# EAGLE schematic OSSI-1 Beacon (EAGLE 6.5.0)

## Sheet 1 of 4
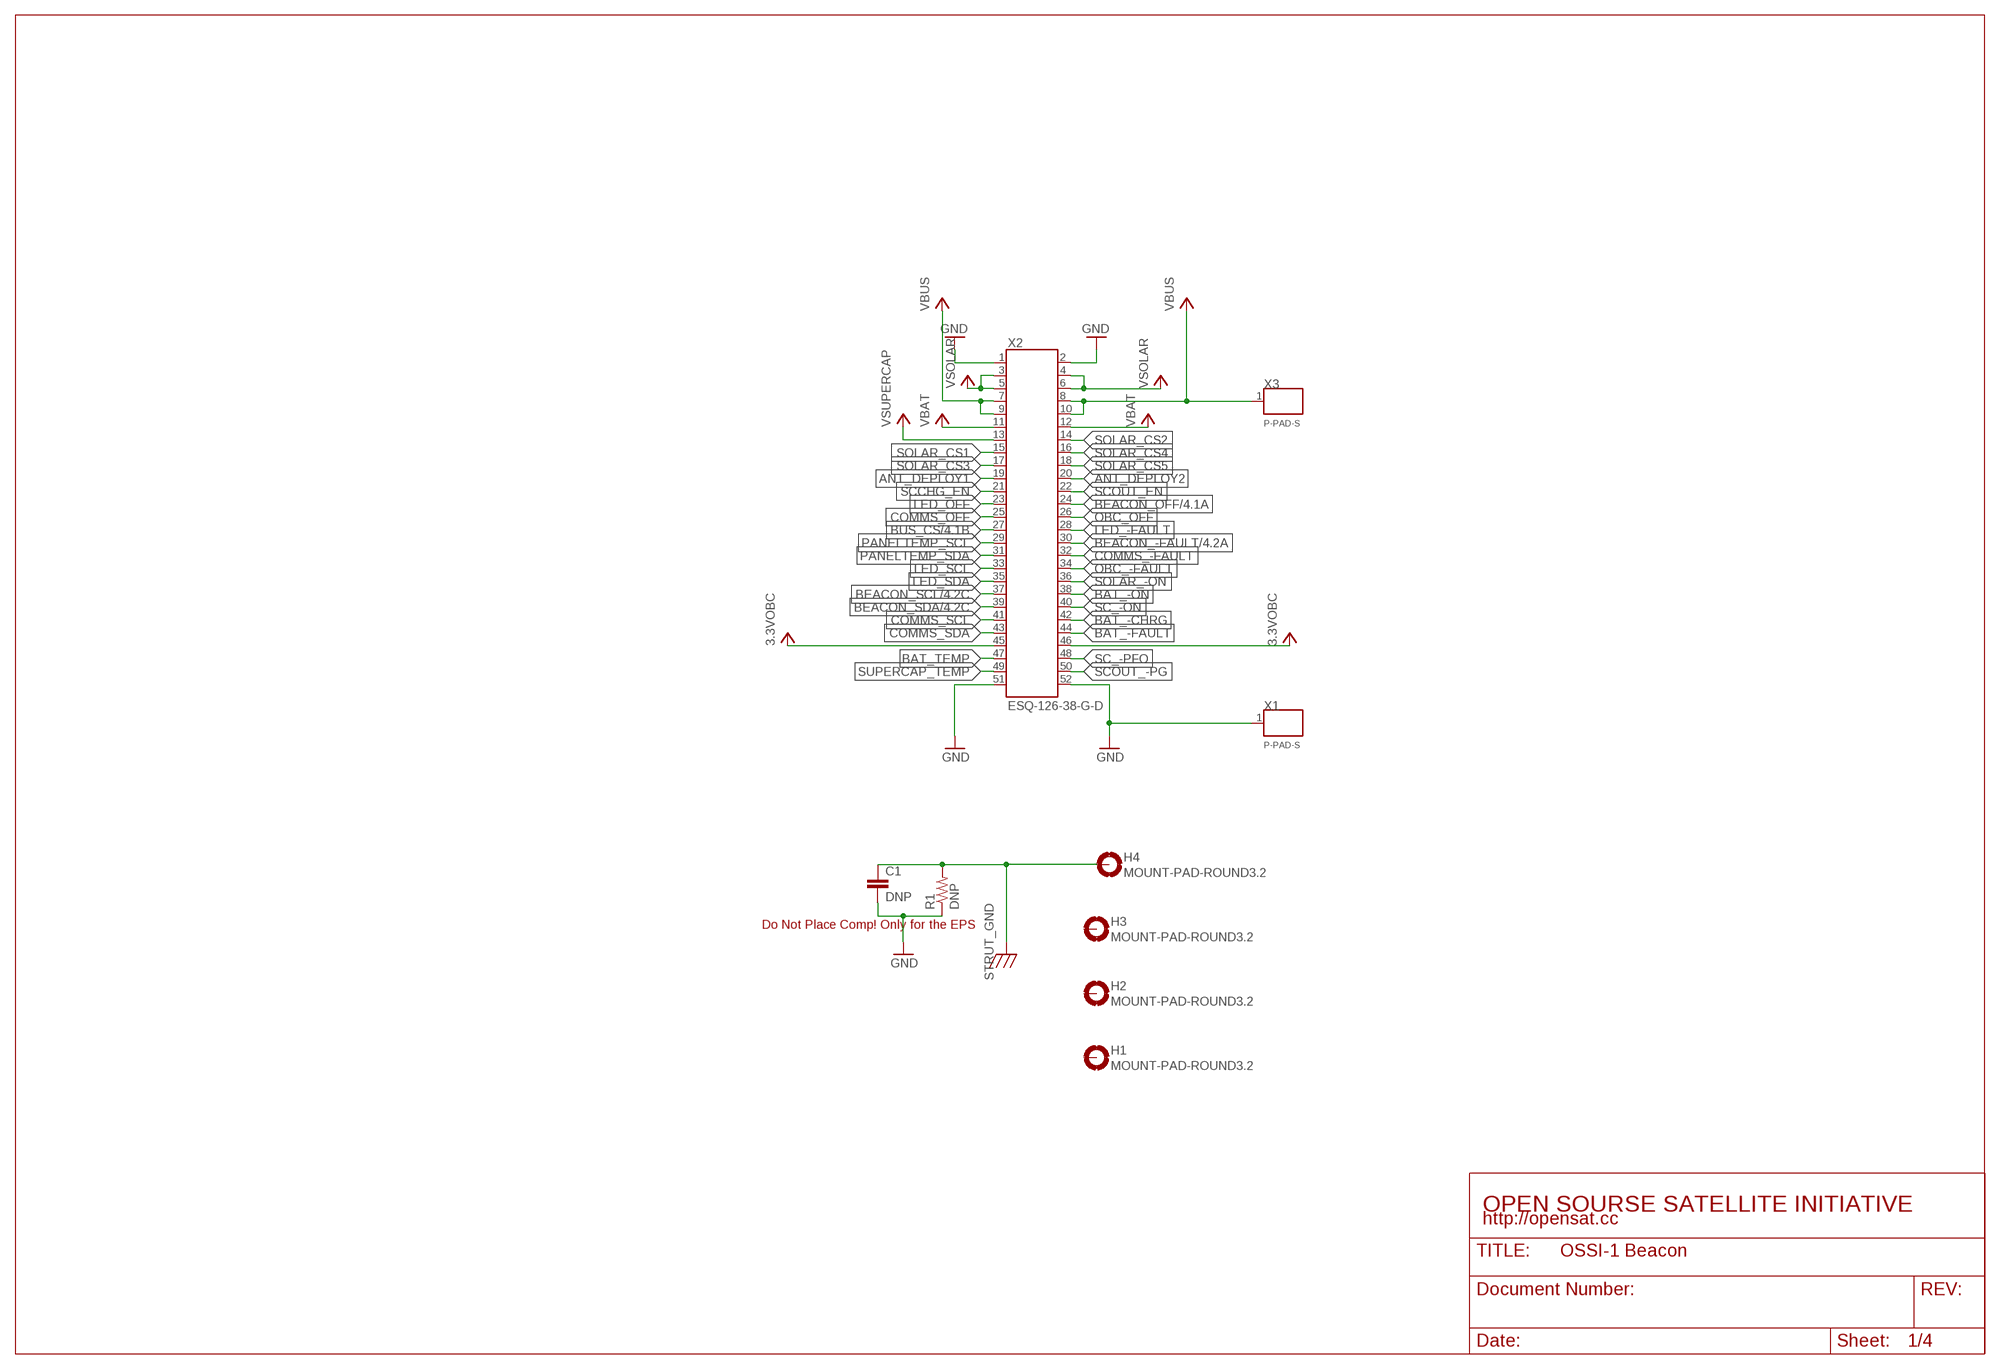
[diagram p0: schematic, sheet 1]

### Parts
C1  DNP  C0805(2012)  [C0805(2012)]
H1  MOUNT-PAD-ROUND3.2  [3.2-PAD-ROUND]
H2  MOUNT-PAD-ROUND3.2  [3.2-PAD-ROUND]
H3  MOUNT-PAD-ROUND3.2  [3.2-PAD-ROUND]
H4  MOUNT-PAD-ROUND3.2  [3.2-PAD-ROUND]
R1  DNP  RWSL1206  [WSL1206]
X1  P-PAD-S  [P-PAD-S]
X2  ESQ-126-38-G-D  [ESQ-126-XX-X-D]
X3  P-PAD-S  [P-PAD-S]

### Nets
3.3VOBC: X2.45 X2.46
ANT_DEPLOY1: X2.19
ANT_DEPLOY2: X2.20
BAT_-CHRG: X2.42
BAT_-FAULT: X2.44
BAT_-ON: X2.38
BAT_TEMP: X2.47
BEACON_-FAULT: X2.30 ; also sheet 4
BEACON_OFF: X2.24 ; also sheet 4
BEACON_SCL: X2.37 ; also sheet 4
BEACON_SDA: X2.39 ; also sheet 4
BUS_CS: X2.27 ; also sheet 4
COMMS_-FAULT: X2.32
COMMS_OFF: X2.25
COMMS_SCL: X2.41
COMMS_SDA: X2.43
GND: C1.2 R1.P$1 X1.1 X2.1 X2.2 X2.51 X2.52 ; also sheet 2,3,4
LED_-FAULT: X2.28
LED_OFF: X2.23
LED_SCL: X2.33
LED_SDA: X2.35
OBC_-FAULT: X2.34
OBC_OFF: X2.26
PANELTEMP_SCL: X2.29
PANELTEMP_SDA: X2.31
SC_-ON: X2.40
SC_-PFO: X2.48
SCCHG_EN: X2.21
SCOUT_-PG: X2.50
SCOUT_EN: X2.22
SOLAR_-ON: X2.36
SOLAR_CS1: X2.15
SOLAR_CS2: X2.14
SOLAR_CS3: X2.17
SOLAR_CS4: X2.16
SOLAR_CS5: X2.18
STRUT_GND: C1.1 H4.B3,2(MOUNT) R1.P$2
SUPERCAP_TEMP: X2.49
VBAT: X2.11 X2.12
VBUS: X2.7 X2.8 X2.9 X2.10 X3.1 ; also sheet 2,4
VSOLAR: X2.3 X2.4 X2.5 X2.6
VSUPERCAP: X2.13
Unconnected: H1.B3,2(MOUNT) H2.B3,2(MOUNT) H3.B3,2(MOUNT)

### Notes on the sheet
- Do Not Place Comp! Only for the EPS
- OPEN SOURSE SATELLITE INITIATIVE
- http://opensat.cc

## Sheet 2 of 4
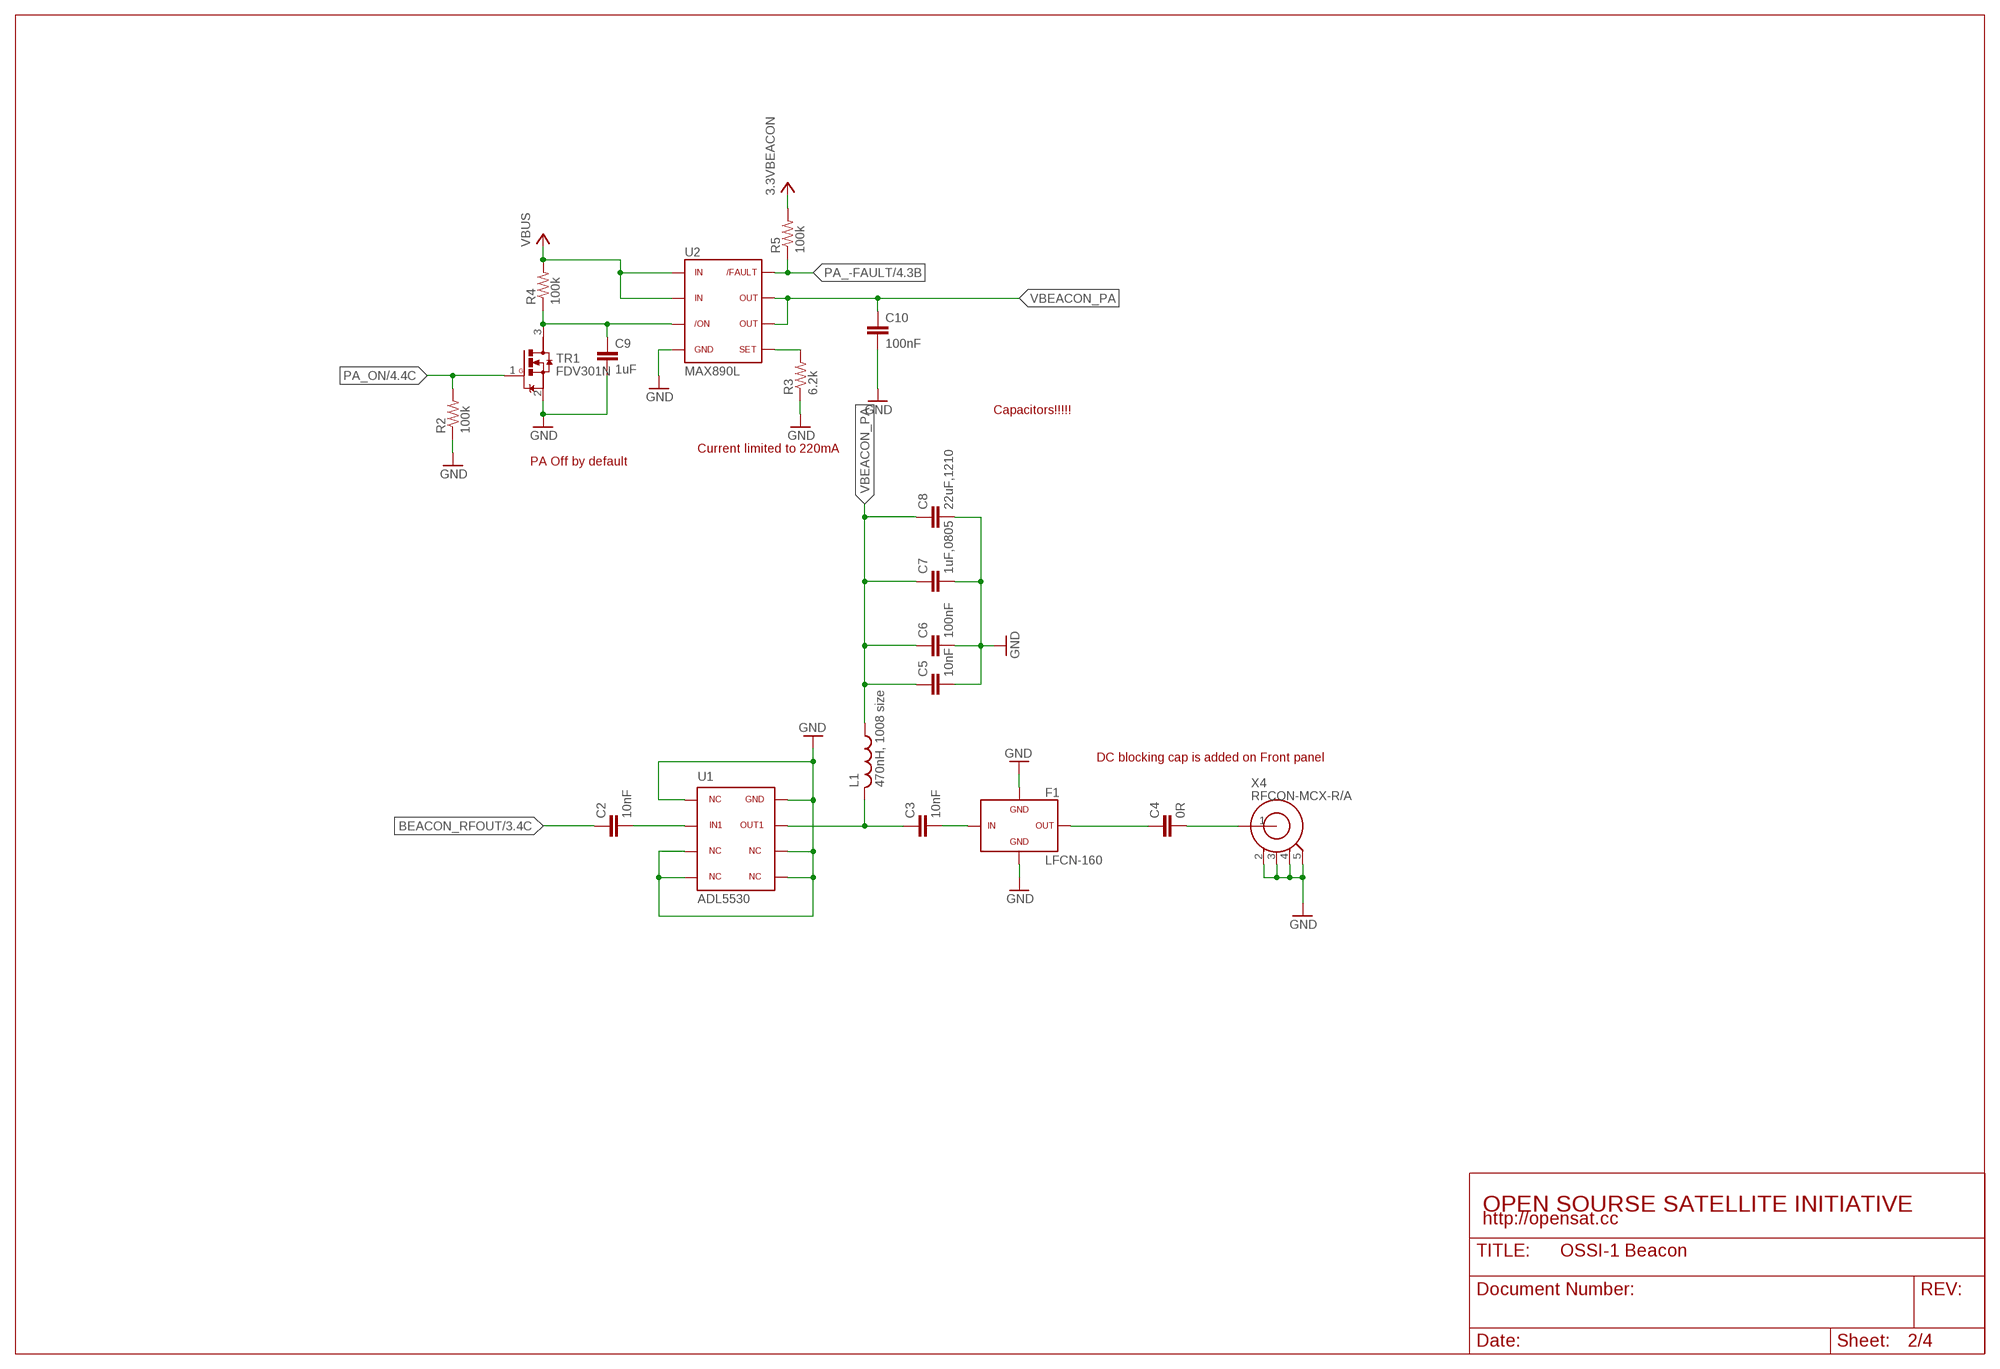
[diagram p1: schematic, sheet 2]

### Parts
C2  10nF  C0603(1608)  [C0603(1608)]
C3  10nF  C0603(1608)  [C0603(1608)]
C4  0R  C0603(1608)  [C0603(1608)]
C5  10nF  C0603(1608)  [C0603(1608)]
C6  100nF  C0603(1608)  [C0603(1608)]
C7  1uF,0805  C0805(2012)  [C0805(2012)]
C8  22uF,1210  C1210(3225)-GCM32  [C1210-GCM32]
C9  1uF  C0603(1608)  [C0603(1608)]
C10  100nF  C0603(1608)  [C0603(1608)]
F1  LFCN-160  [LFCN]
L1  470nH, 1008 size  L1008(2502)  [L1008(2520)]
R2  100k  R0603(1608)  [R0603(1608)]
R3  6.2k  R0603(1608)  [R0603(1608)]
R4  100k  R0603(1608)  [R0603(1608)]
R5  100k  R0603(1608)  [R0603(1608)]
TR1  FDV301N  [SOT23]
U1  ADL5530  [LFCSP8_CP]
U2  MAX890L  [SO8]
X4  RFCON-MCX-R/A  [MCX-R/A]

### Nets
3.3VBEACON: R5.2 ; also sheet 4
BEACON_RFOUT: C2.1 ; also sheet 3
GND: C5.2 C6.2 C7.2 C8.P$2 C9.2 C10.2 F1.2 F1.4 R2.1 R3.1 TR1.2(S) U1.1 U1.3 U1.4 U1.5 U1.6 U1.8 U2.4 X4.2 X4.3 X4.4 X4.5 ; also sheet 1,3,4
N$19: C9.1 R4.1 TR1.3(D) U2.3
N$21: R3.2 U2.5
N$28: C2.2 U1.2
N$30: C3.1 L1.P$2 U1.7
N$34: C3.2 F1.1
N$35: C4.1 F1.3
N$37: C4.2 X4.1
PA_-FAULT: R5.1 U2.8 ; also sheet 4
PA_ON: R2.2 TR1.1(G) ; also sheet 4
VBEACON_PA: C5.1 C6.1 C7.1 C8.P$1 C10.1 L1.P$1 U2.6 U2.7
VBUS: R4.2 U2.1 U2.2 ; also sheet 1,4

### Notes on the sheet
- Capacitors!!!!!
- Current limited to 220mA
- PA Off by default
- DC blocking cap is added on Front panel
- OPEN SOURSE SATELLITE INITIATIVE
- http://opensat.cc

## Sheet 3 of 4
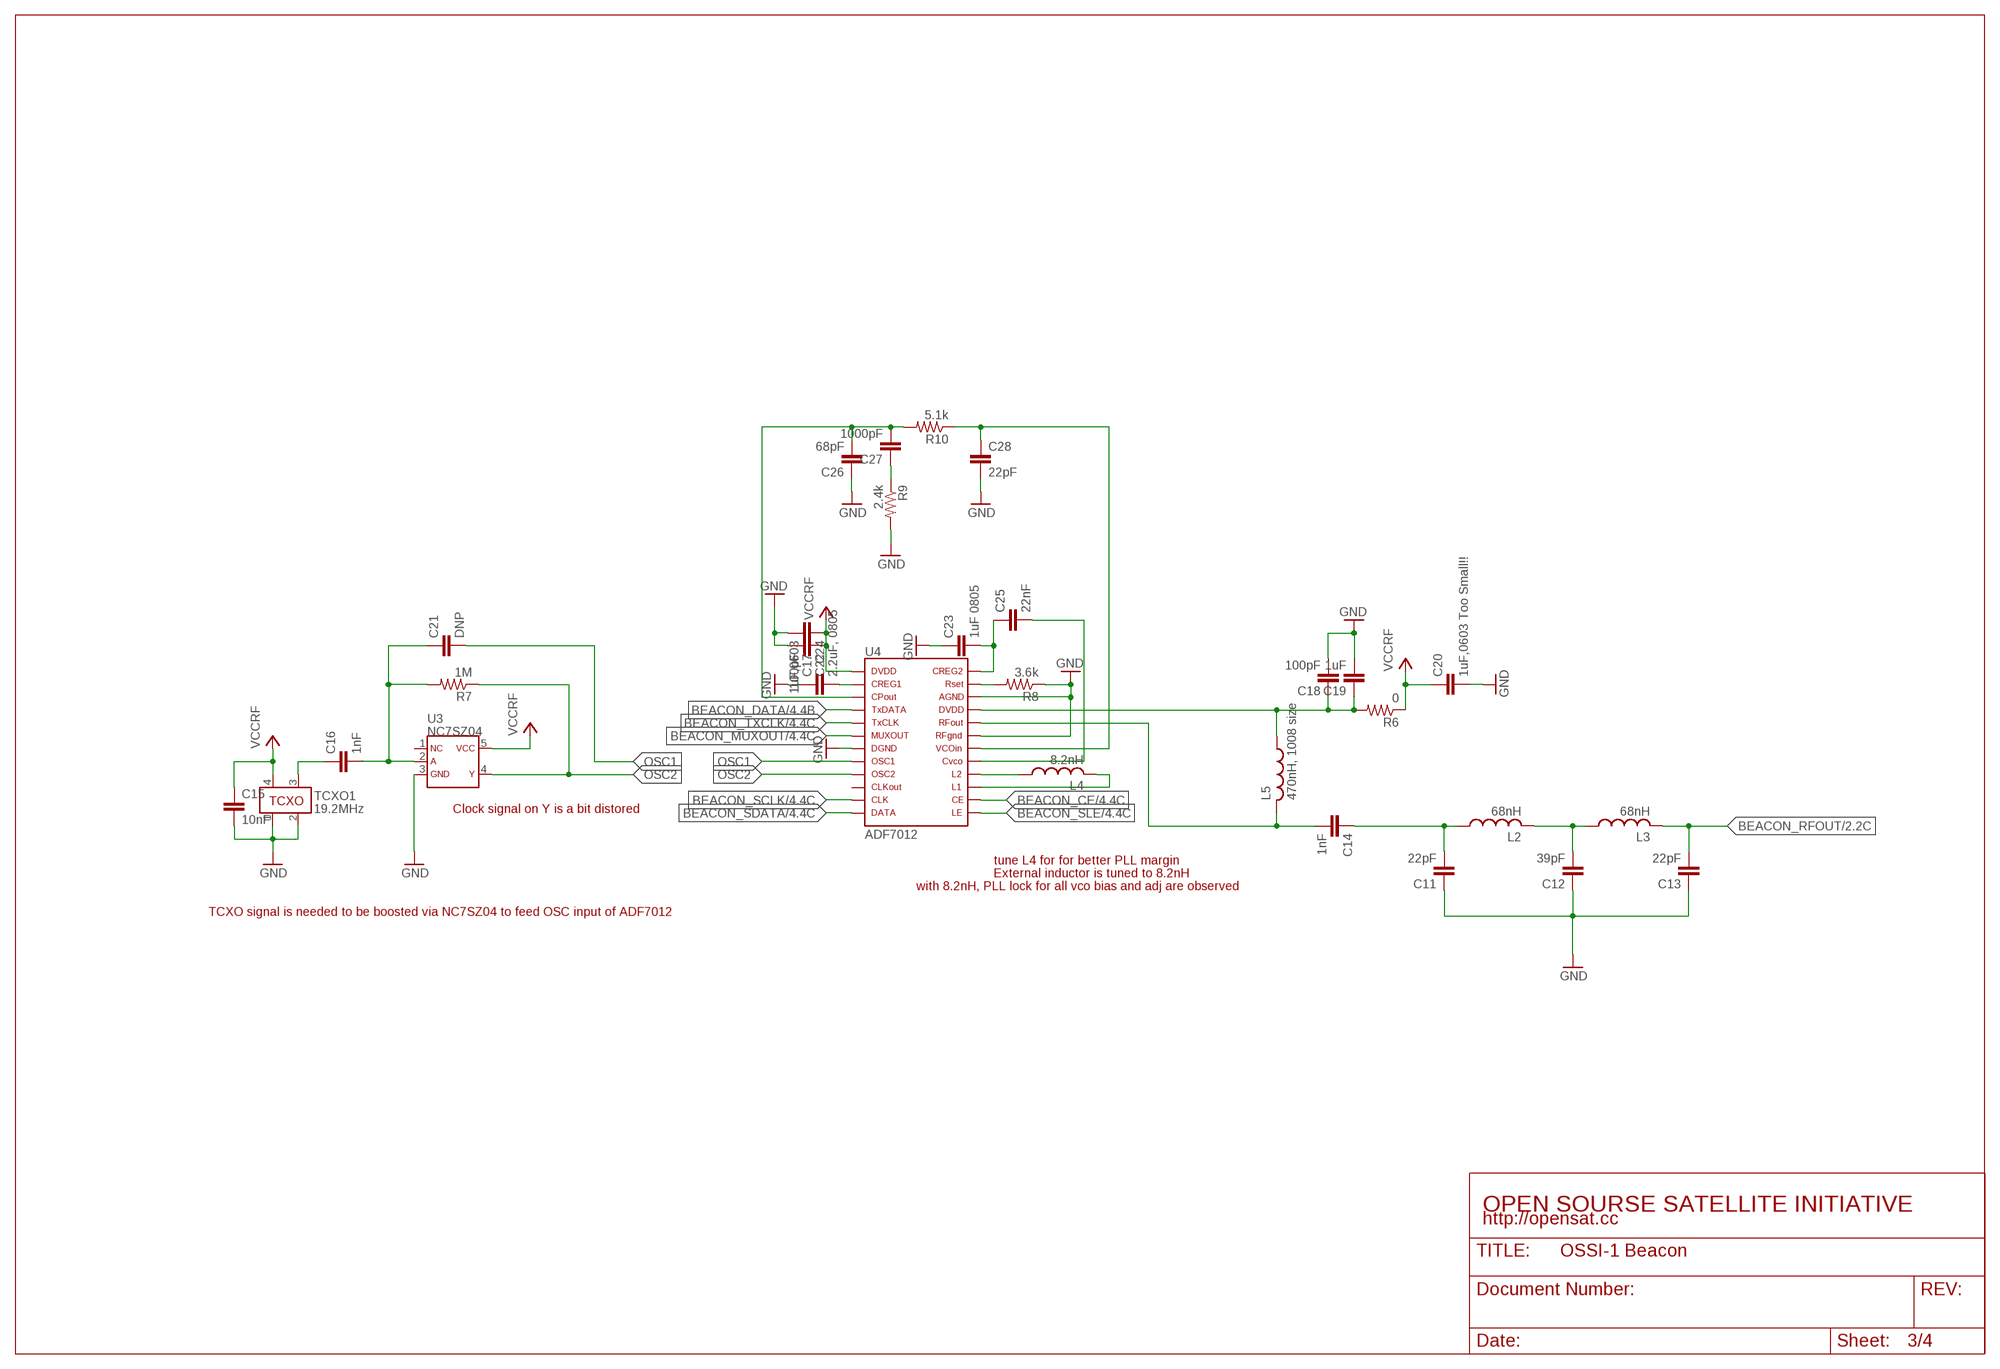
[diagram p2: schematic, sheet 3]

### Parts
C11  22pF  C0603(1608)  [C0603(1608)]
C12  39pF  C0603(1608)  [C0603(1608)]
C13  22pF  C0603(1608)  [C0603(1608)]
C14  1nF  C0603(1608)  [C0603(1608)]
C15  10nF  C0603(1608)  [C0603(1608)]
C16  1nF  C0603(1608)  [C0603(1608)]
C17  2.2uF, 0805  C0805(2012)  [C0805(2012)]
C18  100pF  C0603(1608)  [C0603(1608)]
C19  1uF  C0603(1608)  [C0603(1608)]
C20  1uF,0603 Too Small!!  C0603(1608)  [C0603(1608)]
C21  DNP  C0603(1608)  [C0603(1608)]
C22  100pF  C0603(1608)  [C0603(1608)]
C23  1uF 0805  C0805(2012)  [C0805(2012)]
C24  1uF,0603  C0603(1608)  [C0603(1608)]
C25  22nF  C0603(1608)  [C0603(1608)]
C26  68pF  C0603(1608)  [C0603(1608)]
C27  1000pF  C0603(1608)  [C0603(1608)]
C28  22pF  C0603(1608)  [C0603(1608)]
L2  68nH  L0603(1608)  [L0603(1608)]
L3  68nH  L0603(1608)  [L0603(1608)]
L4  8.2nH  L0603(1608)  [L0603(1608)]
L5  470nH, 1008 size  L1008(2502)  [L1008(2520)]
R6  0  R0603(1608)  [R0603(1608)]
R7  1M  R0603(1608)  [R0603(1608)]
R8  3.6k  R0603(1608)  [R0603(1608)]
R9  2.4k  R0603(1608)  [R0603(1608)]
R10  5.1k  R0603(1608)  [R0603(1608)]
TCXO1  19.2MHz  TCXO-M532  [TCXO_M532]
U3  NC7SZ04  [SC70-5]
U4  ADF7012  [TSSOP24]

### Nets
BEACON_CE: U4.14(CE) ; also sheet 4
BEACON_DATA: U4.4(TXDATA) ; also sheet 4
BEACON_MUXOUT: U4.6(MUXOUT) ; also sheet 4
BEACON_RFOUT: C13.2 L3.2 ; also sheet 2
BEACON_SCLK: U4.11(CLK) ; also sheet 4
BEACON_SDATA: U4.12(DATA) ; also sheet 4
BEACON_SLE: U4.13(LE) ; also sheet 4
BEACON_TXCLK: U4.5(TXCLK) ; also sheet 4
GND: C11.1 C12.1 C13.1 C15.2 C17.1 C18.2 C19.2 C20.2 C22.2 C23.1 C24.2 C26.1 C28.2 R8.1 R9.2 TCXO1.1 TCXO1.2 U3.3 U4.7(DGND) U4.19(RFGND) U4.22(AGND) ; also sheet 1,2,4
N$14: L4.1 U4.16(L2)
N$15: L4.2 U4.15(L1)
N$16: C23.2 C25.1 U4.24(CREG2)
N$17: C25.2 U4.17(CVCO)
N$18: R8.2 U4.23(RSET)
N$20: C27.1 R9.1
N$23: C14.2 L5.P$2 U4.20(RFOUT)
N$24: C28.1 R10.1 U4.18(VCOIN)
N$25: C17.2 U4.2(CREG1)
N$26: C26.2 C27.2 R10.2 U4.3(CPOUT)
N$27: C18.1 C19.1 L5.P$1 R6.2 U4.21(DVDD_2)
N$29: C11.2 C14.1 L2.1
N$36: C12.2 L2.2 L3.1
N$38: C16.2 C21.1 R7.2 U3.2
N$69: C16.1 TCXO1.3
OSC1: C21.2 U4.8(OSC1)
OSC2: R7.1 U3.4 U4.9(OSC2)
VCCRF: C15.1 C20.1 C22.1 C24.1 R6.1 TCXO1.4 U3.5 U4.1(DVDD_1) ; also sheet 4
Unconnected: U3.1 U4.10(CLKOUT)

### Notes on the sheet
- Clock signal on Y is a bit distored
- tune L4 for for better PLL margin
- External inductor is tuned to 8.2nH
- with 8.2nH, PLL lock for all vco bias and adj are observed
- TCXO signal is needed to be boosted via NC7SZ04 to feed OSC input of ADF7012
- OPEN SOURSE SATELLITE INITIATIVE
- http://opensat.cc

## Sheet 4 of 4
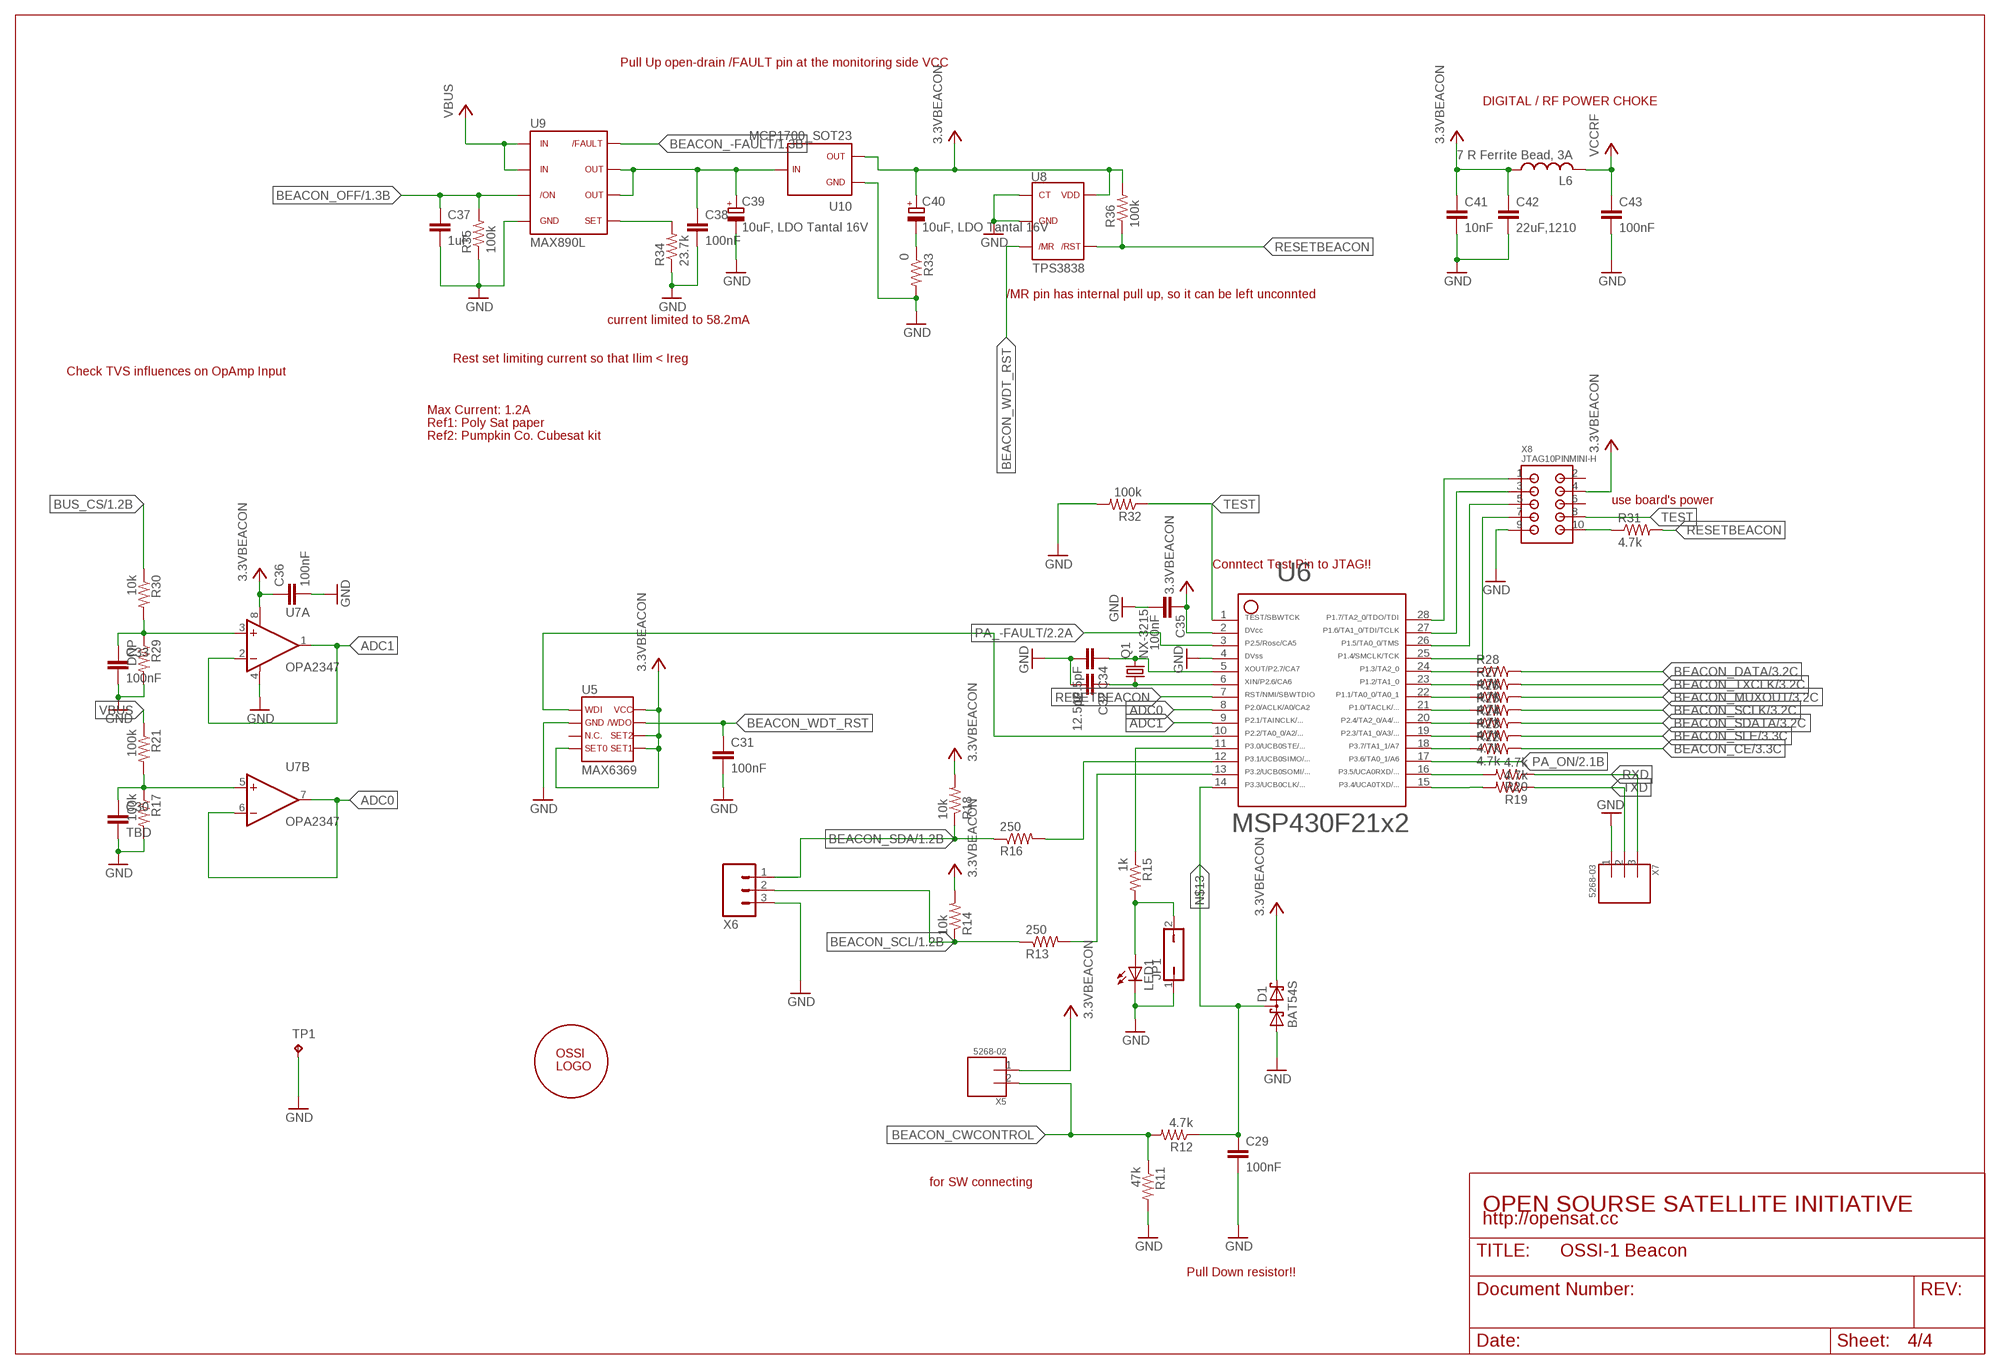
[diagram p3: schematic, sheet 4]

### Parts
C29  100nF  C0603(1608)  [C0603(1608)]
C30  TBD  C0603(1608)  [C0603(1608)]
C31  100nF  C0603(1608)  [C0603(1608)]
C32  12.5pF  C0603(1608)  [C0603(1608)]
C33  100nF  C0603(1608)  [C0603(1608)]
C34  12.5pF  C0603(1608)  [C0603(1608)]
C35  100nF  C0603(1608)  [C0603(1608)]
C36  100nF  C0603(1608)  [C0603(1608)]
C37  1uF  C0603(1608)  [C0603(1608)]
C38  100nF  C0603(1608)  [C0603(1608)]
C39  10uF, LDO Tantal 16V  C-TANTAL-A  [C1206(3216)-A]
C40  10uF, LDO Tantal 16V  C-TANTAL-A  [C1206(3216)-A]
C41  10nF  C0603(1608)  [C0603(1608)]
C42  22uF,1210  C1210(3225)-GCM32  [C1210-GCM32]
C43  100nF  C0603(1608)  [C0603(1608)]
D1  BAT54S  [SOT23]
JP1  JP1Q  [JP1]
L6  7 R Ferrite Bead, 3A  L0805(2012)  [L0805(2012)]
LED1  LED0603  [LED-0603]
Q1  NX-3215  [NX-3215]
R11  47k  R0603(1608)  [R0603(1608)]
R12  4.7k  R0603(1608)  [R0603(1608)]
R13  250  R0603(1608)  [R0603(1608)]
R14  10k  R0603(1608)  [R0603(1608)]
R15  1k  R0603(1608)  [R0603(1608)]
R16  250  R0603(1608)  [R0603(1608)]
R17  100k  R0603(1608)  [R0603(1608)]
R18  10k  R0603(1608)  [R0603(1608)]
R19  4.7k  R0603(1608)  [R0603(1608)]
R20  4.7k  R0603(1608)  [R0603(1608)]
R21  100k  R0603(1608)  [R0603(1608)]
R22  4.7k  R0603(1608)  [R0603(1608)]
R23  4.7k  R0603(1608)  [R0603(1608)]
R24  4.7k  R0603(1608)  [R0603(1608)]
R25  4.7k  R0603(1608)  [R0603(1608)]
R26  4.7k  R0603(1608)  [R0603(1608)]
R27  4.7k  R0603(1608)  [R0603(1608)]
R28  4.7k  R0603(1608)  [R0603(1608)]
R29  DNP  R0603(1608)  [R0603(1608)]
R30  10k  R0603(1608)  [R0603(1608)]
R31  4.7k  R0603(1608)  [R0603(1608)]
R32  100k  R0603(1608)  [R0603(1608)]
R33  0  R0603(1608)  [R0603(1608)]
R34  23.7k  R0603(1608)  [R0603(1608)]
R35  100k  R0603(1608)  [R0603(1608)]
R36  100k  R0603(1608)  [R0603(1608)]
TP1  TP  [TP-13]
U5  MAX6369  [SOT23-8]
U6  MSP430F2132  [PW28]
U7  OPA2347  [SOT23-8DCN]
U8  TPS3838  [SOT23-5DBV]
U9  MAX890L  [SO8]
U10  MCP1700_SOT23  [SOT23]
U$1  OSSILOGORECT  [OSSILOGORECT1005]
X5  5268-02  [5628-02]
X6  M03PTH  [1X03]
X7  5268-03  [5268-03]
X8  JTAG10PINMINI-H  [M50-3200545]

### Nets
3.3VBEACON: C35.1 C36.1 C40.1(+) C41.1 C42.P$1 D1.2(C2) L6.1 R14.2 R18.2 R36.2 U5.4 U5.5 U5.6 U5.8 U6.2 U7.8(A:V+) U8.5 U10.2 X5.1 X8.4 ; also sheet 2
ADC0: U6.8 U7.6(B:-IN) U7.7(B:OUT)
ADC1: U6.9 U7.1(A:OUT) U7.2(A:-IN)
BEACON_-FAULT: U9.8 ; also sheet 1
BEACON_CE: R22.2 ; also sheet 3
BEACON_CWCONTROL: R11.1 R12.2 X5.2
BEACON_DATA: R28.2 ; also sheet 3
BEACON_MUXOUT: R26.2 ; also sheet 3
BEACON_OFF: C37.1 R35.2 U9.3 ; also sheet 1
BEACON_SCL: R13.1 R14.1 X6.2 ; also sheet 1
BEACON_SCLK: R25.2 ; also sheet 3
BEACON_SDA: R16.1 R18.1 X6.1 ; also sheet 1
BEACON_SDATA: R24.2 ; also sheet 3
BEACON_SLE: R23.2 ; also sheet 3
BEACON_TXCLK: R27.2 ; also sheet 3
BEACON_WDT_RST: C31.1 U5.7 U8.3
BUS_CS: R30.1 ; also sheet 1
GND: C29.2 C30.2 C31.2 C32.2 C33.2 C34.2 C35.2 C36.2 C37.2 C38.2 C39.2(-) C41.2 C42.P$2 C43.2 D1.1(A1) JP1.1 LED1.C R11.2 R17.2 R29.2 R32.2 R33.2 R34.1 R35.1 TP1.TP U5.2 U6.4 U7.4(A:V-) U8.1 U8.2 U9.4 U10.1 X6.3 X7.1 X8.9 ; also sheet 1,2,3
N$1: R15.1 U6.11
N$2: U6.27 X8.3
N$3: U6.26 X8.5
N$4: U6.25 X8.7
N$5: C34.1 Q1.2 U6.5
N$6: C32.1 Q1.1 U6.6
N$7: JP1.2 LED1.A R15.2
N$8: U6.28 X8.1
N$9: R16.2 U6.12
N$10: R13.2 U6.13
N$11: R20.2 U6.16
N$12: U5.1 U6.10
N$13: C29.1 D1.3(C1A2) R12.1 U6.14
N$22: C30.1 R17.1 R21.2 U7.5(B:+IN)
N$31: R31.1 X8.10
N$32: R34.2 U9.5
N$33: C33.1 R29.1 R30.2 U7.3(A:+IN)
N$39: R19.2 U6.15
N$40: C40.2(-) R33.1
N$41: R28.1 U6.24
N$42: R27.1 U6.23
N$43: R26.1 U6.22
N$44: R25.1 U6.21
N$45: R24.1 U6.20
N$46: R23.1 U6.19
N$47: R22.1 U6.18
N$666: C38.1 C39.1(+) U9.6 U9.7 U10.3
PA_-FAULT: U6.3 ; also sheet 2
PA_ON: U6.17 ; also sheet 2
RESETBEACON: R31.2 R36.1 U6.7 U8.4
RXD: R20.1 X7.3
TEST: R32.1 U6.1 X8.8
TXD: R19.1 X7.2
VBUS: R21.1 U9.1 U9.2 ; also sheet 1,2
VCCRF: C43.1 L6.2 ; also sheet 3
Unconnected: U5.3 X8.2 X8.6

### Notes on the sheet
- Pull Up open-drain /FAULT pin at the monitoring side VCC
- DIGITAL / RF POWER CHOKE
- /MR pin has internal pull up, so it can be left unconnted
- current limited to 58.2mA
- Rest set limiting current so that Ilim < Ireg
- Check TVS influences on OpAmp Input
- Max Current: 1.2A
- Ref1: Poly Sat paper
- Ref2: Pumpkin Co. Cubesat kit
- use board's power
- Conntect Test Pin to JTAG!!
- for SW connecting
- OPEN SOURSE SATELLITE INITIATIVE
- http://opensat.cc
- Pull Down resistor!!

## Library data of the parts
C1-C38 C41-C43 = OSSI:C
C39 C40 = OSSI:C-TANTAL-A: TAJA105M020RNJ Tantal Capacitor Manufacturer: AVX 1206(3126) Ref: www.avx.com/docs/techinfo/tantappl.pdf
D1 = OSSI:BAT54S: Schottky Diodes Pin connection corrected 2011-05-04 Source: Fairchild .. BAT54.pdf
F1 = OSSI:LFCN-160: LFCN-160 Low Pass Filter DC - 160MHz Low Pass Filter Cut Off Freq: 230MHz 8W power rating ( degraded to 3W at 100 celcius degree)
H1-H4 = OSSI:MOUNT-PAD-ROUND
JP1 = OSSI:JP1Q: JUMPER
L1-L6 = OSSI:L
LED1 = SparkFun:LED: LEDs Standard schematic elements and footprints for 5mm, 3mm, 1206, and 0603 sized LEDs. 5mm - Spark Fun Electronics SKU : COM-00529 (and others)
Q1 = OSSI:NX-3215: NDK 32.768 kHz SMD Crystal P/N: NX3215SA-32.768K-STD-MUA-9 Nominal frequency (kHz): 32.768 Package Size (L×W×H : mm): 3.2×1.5×0.8 Operating Temperature Range(*1) / Storage Temperature Range (°C): -40 to +85 / -40 to +85 Level of drive: 0.1µW (Max. 0.5µW) Frequency Tolerance (25±3°C): ±20×10-6 Load Capacitance: 9.0pF, 12.5pF Equivalent Series Resistance: 70kΩ Max. Ordering Code: NX3215SA-32.768K-STD-MUA-9 (Load Capacitance9.0pF) /NX3215SA-32.768K-STD-MUA-8 (Load Capacitance12.5pF)
R1-R36 = OSSI:R
TCXO1 = OSSI:TCXO-M532: 532L25DT19M2000: CTO electronic components Model 532 19.2MHz TCXO for RF transeiver Clipped Sine Wave Output Operating Voltage, +3.3Vdc Operating Temperature to -30°C to +85°C Frequency Stability: ±2.5ppm
TP1 = OSSI:TP
TR1 = OSSI:FDV301N: FDV301N Digital N channel - FET / Rdson = 5 Ohm / Vgs = 0.7~1.06V / Ids = 220mA
U1 = OSSI:ADL5530: ADL5530 IF Gain Block Fixed gain: 16.dB Operation: 0~1000Mhz Internally matched input and output to 50 Ω Power supply: 3V or 5V 110 mA power supply current
U2 U9 = OSSI:MAX890L: MAX 890L 1.2A, Current-Limited, High-Side P-Channel Switch with Thermal Shutdown BY MAXIM
U3 = OSSI:NC7SZ04: UHS Inverter NC7SZ04
U4 = OSSI:ADF7012
U5 = OSSI:MAX6369: MAX6369 Pin-Selectable Watchdog Timers Max 6369 is Open-drain output 1 ms to 60 s seletable timeout
U6 = OSSI:MSP430F2132: *** MSP430F21x2 *** PW28
U7 = OSSI:OPA2347: OPA2347 RAIL-TO-RAIL INPUT AND OUTPUT SINGLE SUPPLY: 2.3V to 5.5V LOW IQ: 20µ
U8 = OSSI:TPS3838: TPS3838 NanoPower Supervisory IC from texas instruments. TPS3838 is open-drain output
U10 = OSSI:MCP1700: MCP1700 LDO from Microchips
U$1 = OSSI:OSSILOGO
X1 X3 = OSSI:P-PAD
X2 = OSSI:ESQ-126-: Samtec ESQ-126-XX-G-D Elevated Sockets Seires ESQ-126-37-G-D ESQ-126-38-G-D ESQ-126-39-G-D
X4 = OSSI:RFCON: RF Connectors
X5 = OSSI:5268-02
X6 = OSSI:M03: Header 3 Standard 3-pin 0.1" header. Use with straight break away headers (SKU : PRT-00116), right angle break away headers (PRT-00553), swiss pins (PRT-00743), machine pins (PRT-00117), and female headers (PRT-00115). Molex polarized connector foot print use with SKU : PRT-08232 with associated crimp pins and housings.
X7 = OSSI:5268-03
X8 = OSSI:JTAG10PINMINI